# EAGLE schematic Welcome to the Resistance (EAGLE 9.4.2)
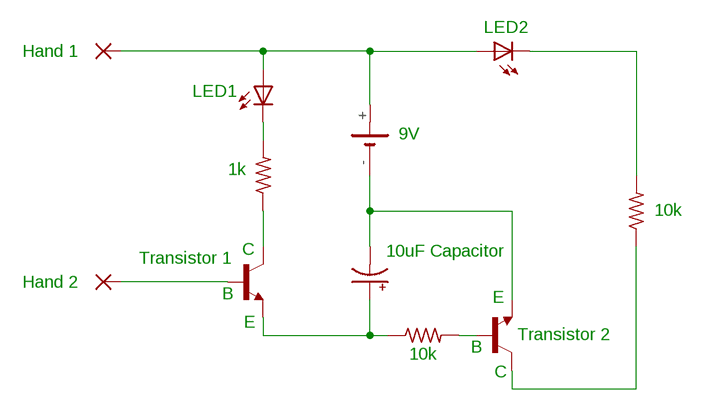
[diagram p0: schematic, sheet 1]

## Parts
C1  CPOL-US085CS-1AR  [085CS_1AR]
G1  SL-150-1/2AA/PR  [SL-150-1/2AA/PR]
LED1  LAP4-BOTTOM  [P47F-BOTTOM]
LED2  LAP4-BOTTOM  [P47F-BOTTOM]
PAD1  2,54/0,8  [2,54/0,8]
PAD2  2,54/0,8  [2,54/0,8]
R1  R-US_0204/2V  [0204V]
R2  R-US_0204/2V  [0204V]
R3  R-US_0204/2V  [0204V]
T1  2N706  [TO18]
T2  2N706  [TO18]

## Nets
N$1: G1.+ LED1.A LED2.A PAD1.1(P)
N$2: LED1.C R3.2
N$3: R3.1 T1.3(C)
N$4: PAD2.1(P) T1.2(B)
N$5: C1.- G1.- T2.1(E)
N$6: LED2.C R2.2
N$7: C1.+ R1.1 T1.1(E)
N$8: R1.2 T2.2(B)
N$9: R2.1 T2.3(C)

## Notes on the sheet
- LED2
- Hand 1
- LED1
- 9V
- 1k
- 10k
- C | 10uF Capacitor
- Transistor 1
- Hand 2
- B | E
- E
- Transistor 2
- B
- 10k
- C

## Library data of the parts
C1 = rcl:CPOL-US: POLARIZED CAPACITOR, American symbol
G1 = battery:SL-150-1/2AA/PR: LI BATTERY Sonnenschein
LED1 LED2 = led:*P4: PointLED® Enhanced Thinfilm LED TOP & BOTTOM mount LS P47F, LR P47F, LA P47F, LY P47F, LT P4SG, LB P4SG, LW P4SG Source: http://catalog.osram-os.com .. LA_LR_LS_LY_P47F_Pb_free.pdf
PAD1 PAD2 = wirepad:2,54/0,8: THROUGH-HOLE PAD
R1-R3 = resistor:R-US_: RESISTOR, American symbol
T1 T2 = transistor:2N706: NPN TRANSISTOR